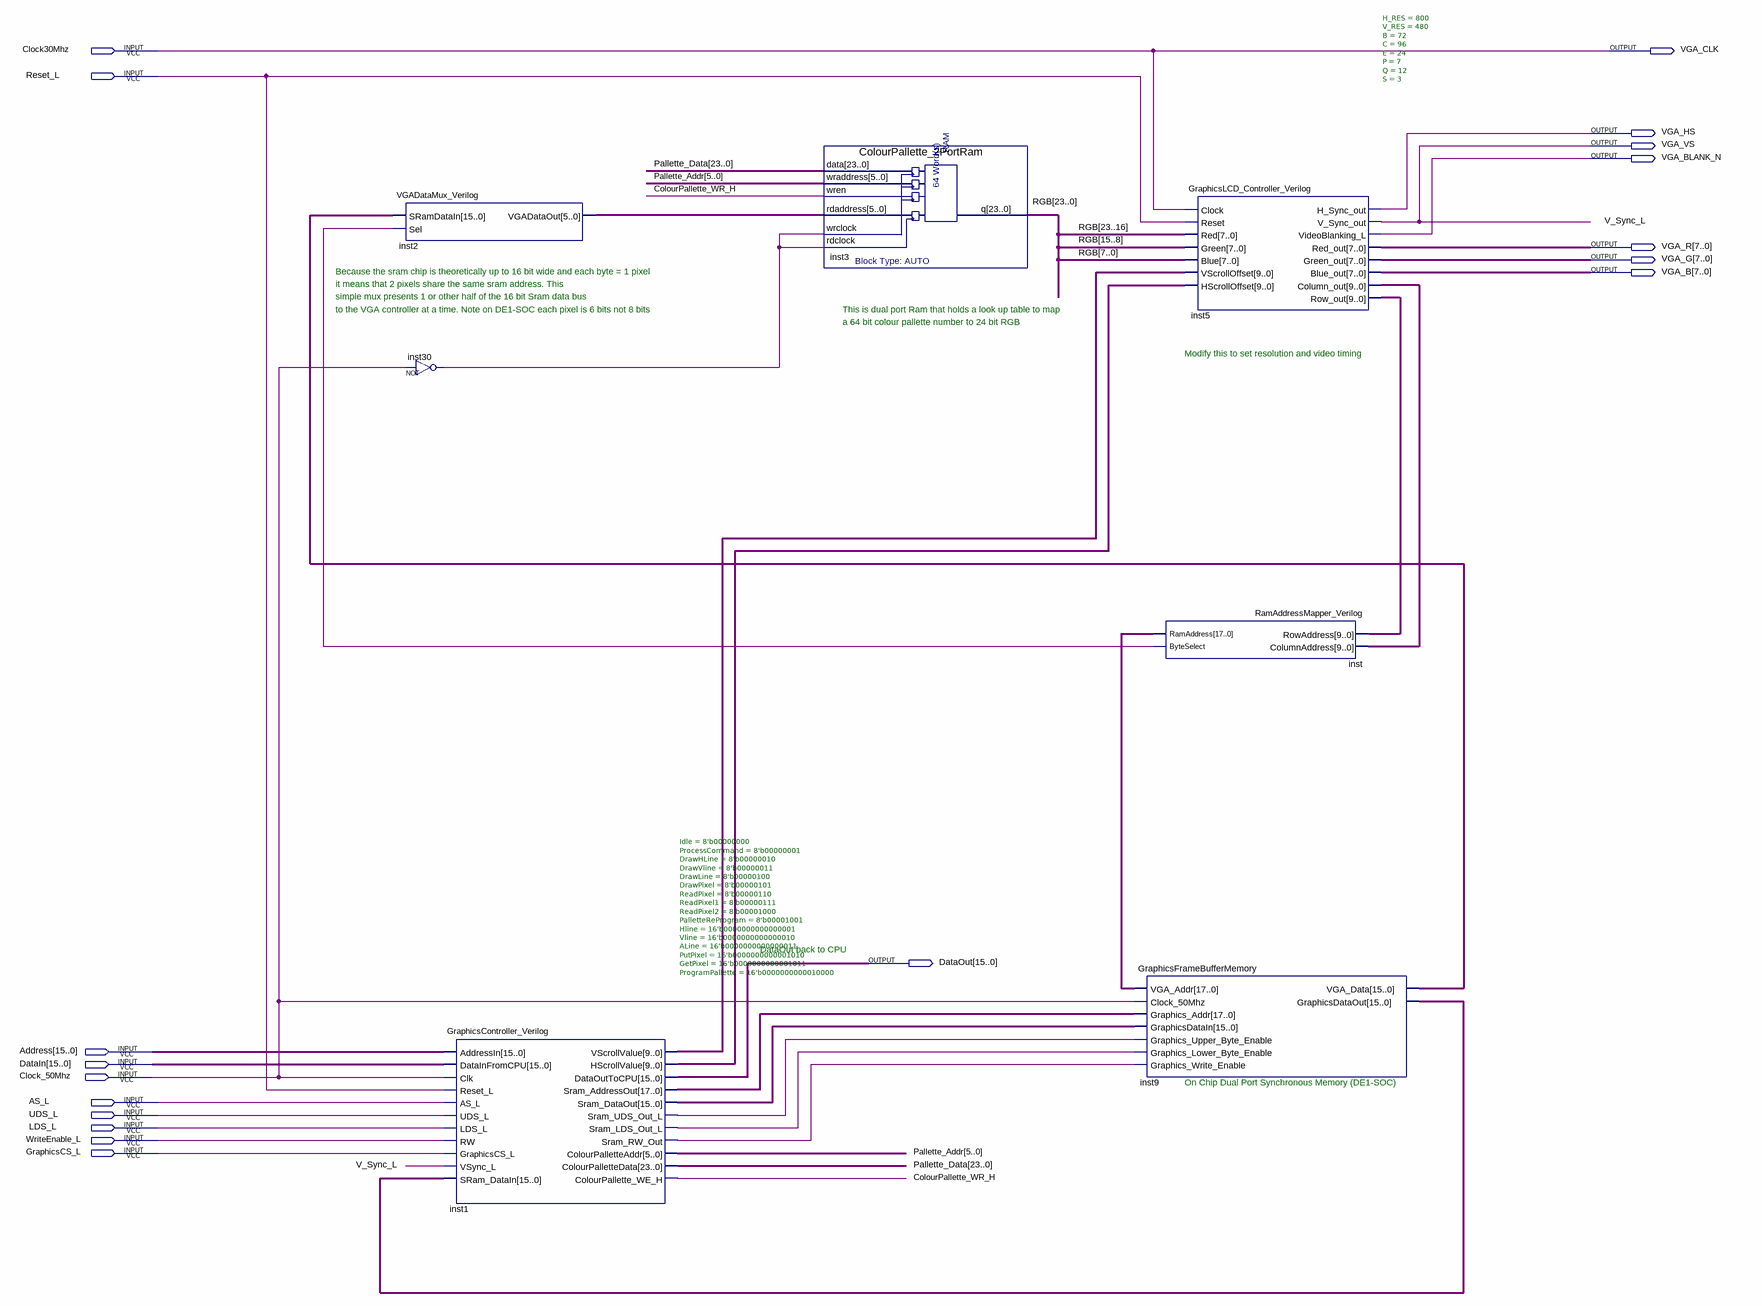
[diagram p0: schematic sheet]
// Quartus schematic Video_Controller800x480.bdf as structural Verilog: 7 symbols, 18 pins
module Video_Controller800x480 (
  input  Clock30Mhz,
  input  Reset_L,
  input  [15:0] Address,
  input  [15:0] DataIn,
  input  Clock_50Mhz,
  input  AS_L,
  input  UDS_L,
  input  LDS_L,
  input  WriteEnable_L,
  input  GraphicsCS_L,
  output VGA_CLK,
  output VGA_HS,
  output VGA_VS,
  output VGA_BLANK_N,
  output [7:0] VGA_R,
  output [7:0] VGA_G,
  output [7:0] VGA_B,
  output [15:0] DataOut
);

  wire ColourPallette_WR_H, inst1_sram_lds_out_l, inst1_sram_rw_out, inst1_sram_uds_out_l, inst30_out,
       inst_byteselect;
  wire [5:0] inst2_vgadataout, Pallette_Addr;
  wire [9:0] inst1_hscrollvalue, inst1_vscrollvalue, inst5_column_out, inst5_row_out;
  wire [15:0] inst1_sram_dataout, inst9_graphicsdataout, inst9_vga_data;
  wire [17:0] inst1_sram_addressout, inst_ramaddress;
  wire [23:0] Pallette_Data, RGB;

  VGADataMux_Verilog inst2 (.SRamDataIn(inst9_vga_data), .Sel(inst_byteselect), .VGADataOut(inst2_vgadataout));
  not inst30 (inst30_out, Clock_50Mhz);
  GraphicsController_Verilog #(.Idle(8'b00000000), .ProcessCommand(8'b00000001), .DrawHLine(8'b00000010), .DrawVline(8'b00000011), .DrawLine(8'b00000100), .DrawPixel(8'b00000101), .ReadPixel(8'b00000110), .ReadPixel1(8'b00000111), .ReadPixel2(8'b00001000), .PalletteReProgram(8'b00001001), .Hline(16'b0000000000000001), .Vline(16'b0000000000000010), .ALine(16'b0000000000000011), .PutPixel(16'b0000000000001010), .GetPixel(16'b0000000000001011), .ProgramPallette(16'b0000000000010000)) inst1 (
    .AddressIn(Address), .DataInFromCPU(DataIn), .Clk(Clock_50Mhz), .Reset_L(Reset_L), .AS_L(AS_L),
    .UDS_L(UDS_L), .LDS_L(LDS_L), .RW(WriteEnable_L), .GraphicsCS_L(GraphicsCS_L), .VSync_L(VGA_VS),
    .SRam_DataIn(inst9_graphicsdataout), .VScrollValue(inst1_vscrollvalue),
    .HScrollValue(inst1_hscrollvalue), .DataOutToCPU(DataOut), .Sram_AddressOut(inst1_sram_addressout),
    .Sram_DataOut(inst1_sram_dataout), .Sram_UDS_Out_L(inst1_sram_uds_out_l),
    .Sram_LDS_Out_L(inst1_sram_lds_out_l), .Sram_RW_Out(inst1_sram_rw_out),
    .ColourPalletteAddr(Pallette_Addr), .ColourPalletteData(Pallette_Data),
    .ColourPallette_WE_H(ColourPallette_WR_H));
  ColourPallette_2PortRam inst3 (
    .data(Pallette_Data), .wraddress(Pallette_Addr), .wren(ColourPallette_WR_H),
    .rdaddress(inst2_vgadataout), .wrclock(inst30_out), .rdclock(inst30_out), .q(RGB));
  RamAddressMapper_Verilog inst (
    .RowAddress(inst5_row_out), .ColumnAddress(inst5_column_out), .RamAddress(inst_ramaddress),
    .ByteSelect(inst_byteselect));
  GraphicsFrameBufferMemory inst9 (
    .VGA_Addr(inst_ramaddress), .Clock_50Mhz(Clock_50Mhz), .Graphics_Addr(inst1_sram_addressout),
    .GraphicsDataIn(inst1_sram_dataout), .Graphics_Upper_Byte_Enable(inst1_sram_uds_out_l),
    .Graphics_Lower_Byte_Enable(inst1_sram_lds_out_l), .Graphics_Write_Enable(inst1_sram_rw_out),
    .VGA_Data(inst9_vga_data), .GraphicsDataOut(inst9_graphicsdataout));
  GraphicsLCD_Controller_Verilog #(.H_RES(800), .V_RES(480), .B(72), .C(96), .E(24), .P(7), .Q(12), .S(3)) inst5 (
    .Clock(Clock30Mhz), .Reset(Reset_L), .Red(RGB[23:16]), .Green(RGB[15:8]), .Blue(RGB[7:0]),
    .VScrollOffset(inst1_vscrollvalue), .HScrollOffset(inst1_hscrollvalue), .H_Sync_out(VGA_HS),
    .V_Sync_out(VGA_VS), .VideoBlanking_L(VGA_BLANK_N), .Red_out(VGA_R), .Green_out(VGA_G), .Blue_out(VGA_B),
    .Column_out(inst5_column_out), .Row_out(inst5_row_out));

  assign VGA_CLK = Clock30Mhz;

  // Other names for the same wires on the sheet: V_Sync_L = VGA_VS

  // Notes on the sheet:
  //   Because the sram chip is theoretically up to 16 bit wide and each byte = 1 pixel
  //   it means that 2 pixels share the same sram address. This
  //   simple mux presents 1 or other half of the 16 bit Sram data bus 
  //   to the VGA controller at a time. Note on DE1-SOC each pixel is 6 bits not 8 bits
  //   This is dual port Ram that holds a look up table to map 
  //   a 64 bit colour pallette number to 24 bit RGB
  //   Modify this to set resolution and video timing
  //   DataOut back to CPU
  //   On Chip Dual Port Synchronous Memory (DE1-SOC)
endmodule
